# Altium schematic sheet SCH.SchDoc
size A3
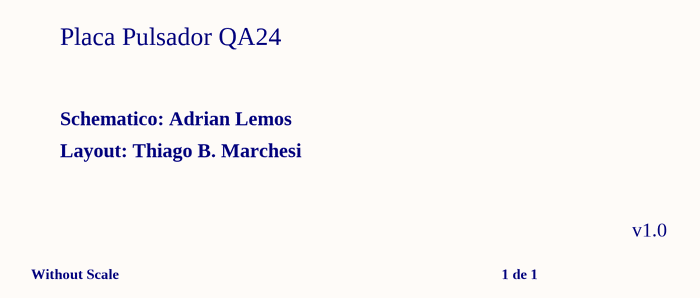
[diagram p0: SCH.SchDoc]

## Notes on the sheet
- Placa Pulsador QA24
- Schematico: Adrian Lemos
- Layout: Thiago B. Marchesi
- Without Scale
- 1 de 1
- v1.0